# Altium schematic sheet 08-DPLL-2.SchDoc
size B; SheetNumber: 8; SheetTotal: 22
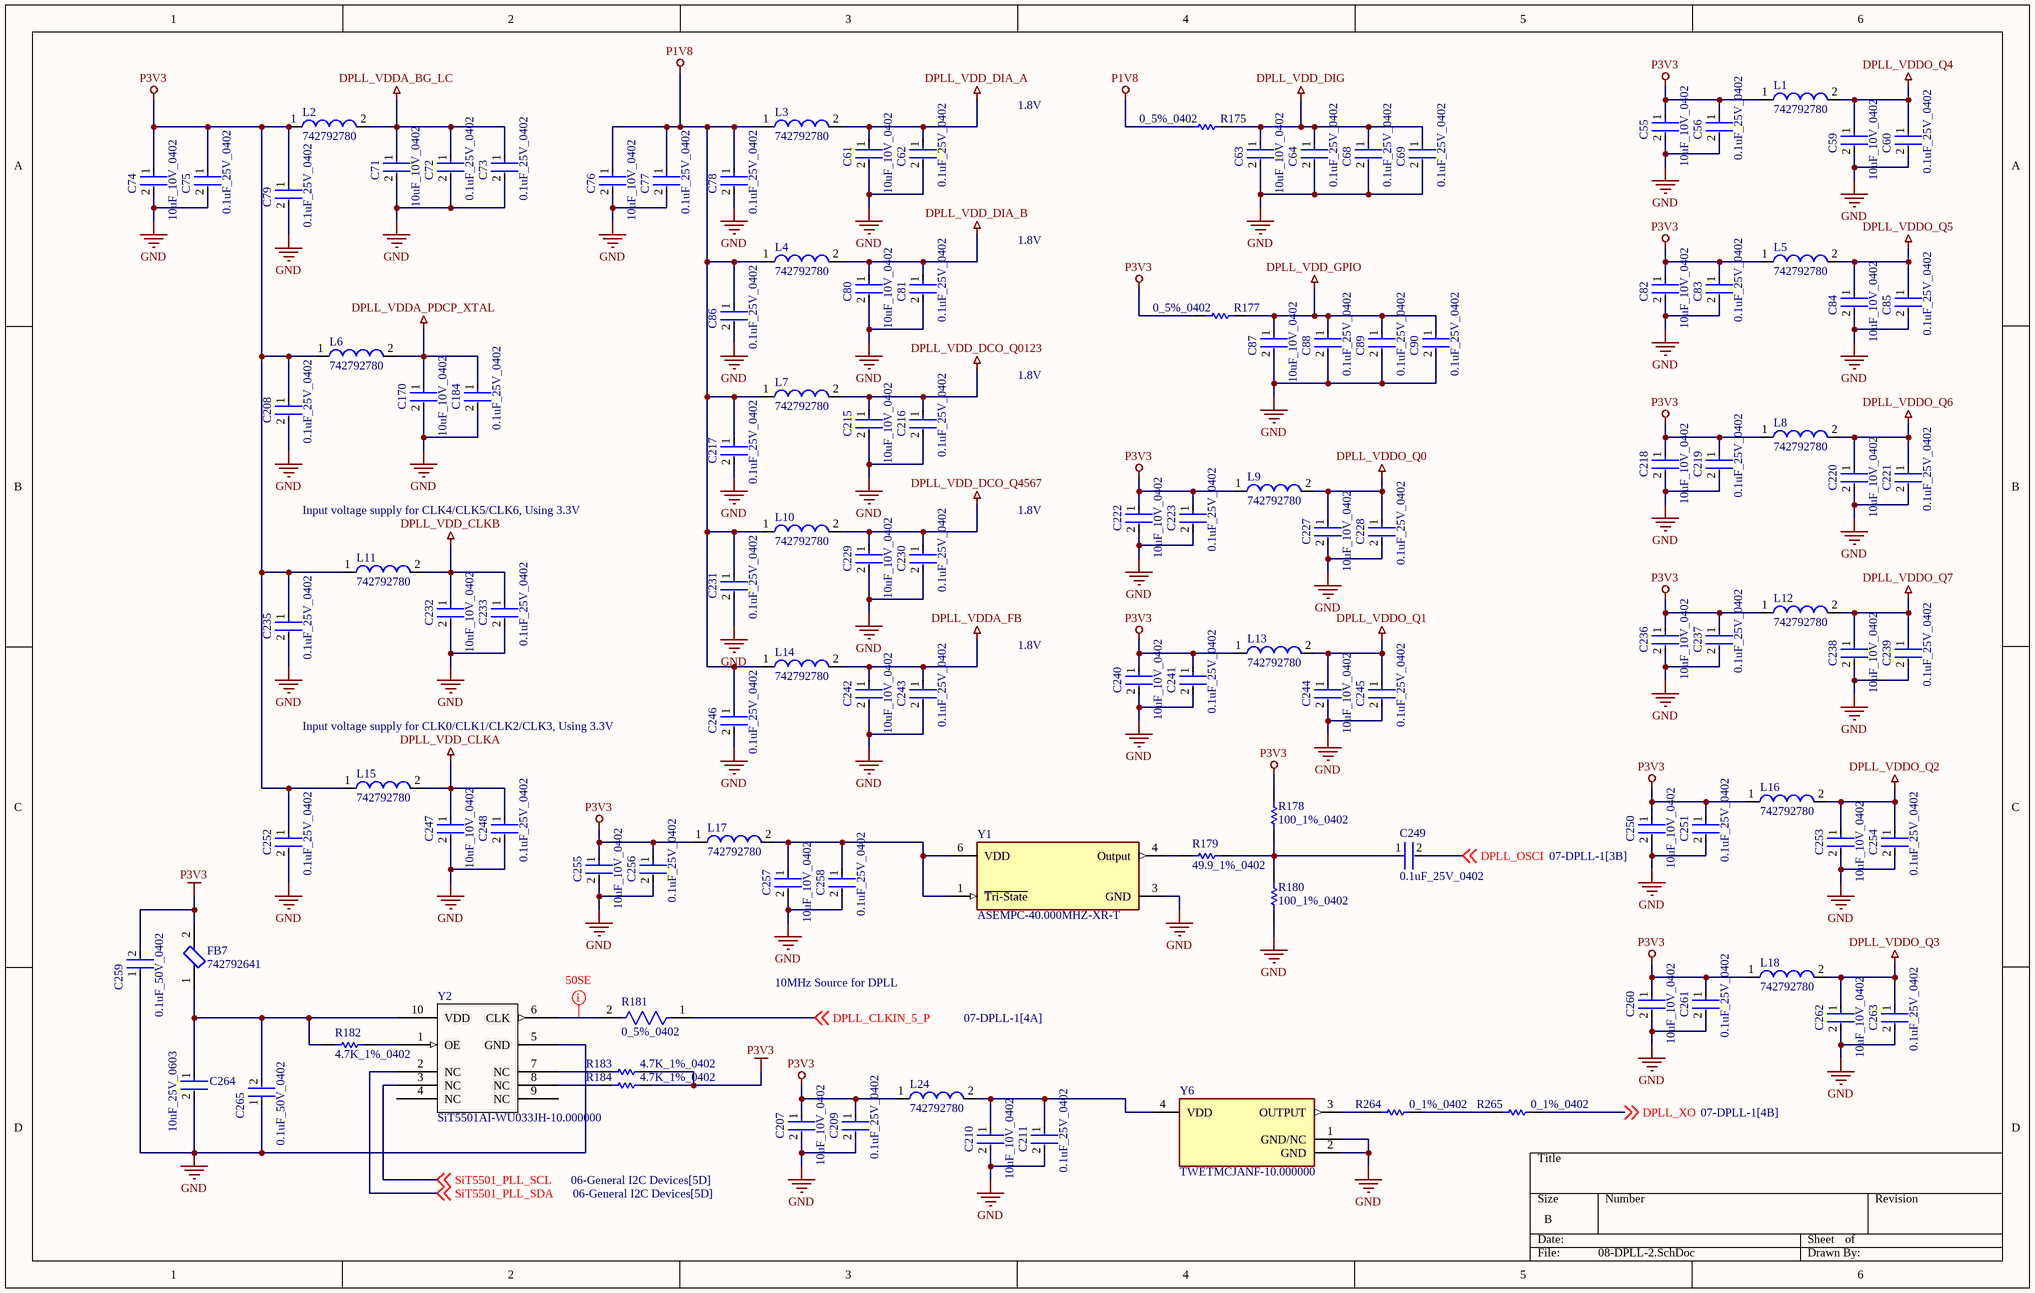
[diagram p0: 08-DPLL-2.SchDoc]

## Parts
C55  10uF_10V_0402  [FP-CL05A106MP5NUNC-MFG]
C56  0.1uF_25V_0402  [FP-0402-L_1_0_1-W_0_5_0_1-IPC_C]
C59  10uF_10V_0402  [FP-CL05A106MP5NUNC-MFG]
C60  0.1uF_25V_0402  [FP-0402-L_1_0_1-W_0_5_0_1-IPC_C]
C61  10uF_10V_0402  [FP-CL05A106MP5NUNC-MFG]
C62  0.1uF_25V_0402  [FP-0402-L_1_0_1-W_0_5_0_1-IPC_C]
C63  10uF_10V_0402  [FP-CL05A106MP5NUNC-MFG]
C64  0.1uF_25V_0402  [FP-0402-L_1_0_1-W_0_5_0_1-IPC_C]
C68  0.1uF_25V_0402  [FP-0402-L_1_0_1-W_0_5_0_1-IPC_C]
C69  0.1uF_25V_0402  [FP-0402-L_1_0_1-W_0_5_0_1-IPC_C]
C71  10uF_10V_0402  [FP-CL05A106MP5NUNC-MFG]
C72  0.1uF_25V_0402  [FP-0402-L_1_0_1-W_0_5_0_1-IPC_C]
C73  0.1uF_25V_0402  [FP-0402-L_1_0_1-W_0_5_0_1-IPC_C]
C74  10uF_10V_0402  [FP-CL05A106MP5NUNC-MFG]
C75  0.1uF_25V_0402  [FP-0402-L_1_0_1-W_0_5_0_1-IPC_C]
C76  10uF_10V_0402  [FP-CL05A106MP5NUNC-MFG]
C77  0.1uF_25V_0402  [FP-0402-L_1_0_1-W_0_5_0_1-IPC_C]
C78  0.1uF_25V_0402  [FP-0402-L_1_0_1-W_0_5_0_1-IPC_C]
C79  0.1uF_25V_0402  [FP-0402-L_1_0_1-W_0_5_0_1-IPC_C]
C80  10uF_10V_0402  [FP-CL05A106MP5NUNC-MFG]
C81  0.1uF_25V_0402  [FP-0402-L_1_0_1-W_0_5_0_1-IPC_C]
C82  10uF_10V_0402  [FP-CL05A106MP5NUNC-MFG]
C83  0.1uF_25V_0402  [FP-0402-L_1_0_1-W_0_5_0_1-IPC_C]
C84  10uF_10V_0402  [FP-CL05A106MP5NUNC-MFG]
C85  0.1uF_25V_0402  [FP-0402-L_1_0_1-W_0_5_0_1-IPC_C]
C86  0.1uF_25V_0402  [FP-0402-L_1_0_1-W_0_5_0_1-IPC_C]
C87  10uF_10V_0402  [FP-CL05A106MP5NUNC-MFG]
C88  0.1uF_25V_0402  [FP-0402-L_1_0_1-W_0_5_0_1-IPC_C]
C89  0.1uF_25V_0402  [FP-0402-L_1_0_1-W_0_5_0_1-IPC_C]
C90  0.1uF_25V_0402  [FP-0402-L_1_0_1-W_0_5_0_1-IPC_C]
C170  10uF_10V_0402  [FP-CL05A106MP5NUNC-MFG]
C184  0.1uF_25V_0402  [FP-0402-L_1_0_1-W_0_5_0_1-IPC_C]
C207  10uF_10V_0402  [FP-CL05A106MP5NUNC-MFG]
C208  0.1uF_25V_0402  [FP-0402-L_1_0_1-W_0_5_0_1-IPC_C]
C209  0.1uF_25V_0402  [FP-0402-L_1_0_1-W_0_5_0_1-IPC_C]
C210  10uF_10V_0402  [FP-CL05A106MP5NUNC-MFG]
C211  0.1uF_25V_0402  [FP-0402-L_1_0_1-W_0_5_0_1-IPC_C]
C215  10uF_10V_0402  [FP-CL05A106MP5NUNC-MFG]
C216  0.1uF_25V_0402  [FP-0402-L_1_0_1-W_0_5_0_1-IPC_C]
C217  0.1uF_25V_0402  [FP-0402-L_1_0_1-W_0_5_0_1-IPC_C]
C218  10uF_10V_0402  [FP-CL05A106MP5NUNC-MFG]
C219  0.1uF_25V_0402  [FP-0402-L_1_0_1-W_0_5_0_1-IPC_C]
C220  10uF_10V_0402  [FP-CL05A106MP5NUNC-MFG]
C221  0.1uF_25V_0402  [FP-0402-L_1_0_1-W_0_5_0_1-IPC_C]
C222  10uF_10V_0402  [FP-CL05A106MP5NUNC-MFG]
C223  0.1uF_25V_0402  [FP-0402-L_1_0_1-W_0_5_0_1-IPC_C]
C227  10uF_10V_0402  [FP-CL05A106MP5NUNC-MFG]
C228  0.1uF_25V_0402  [FP-0402-L_1_0_1-W_0_5_0_1-IPC_C]
C229  10uF_10V_0402  [FP-CL05A106MP5NUNC-MFG]
C230  0.1uF_25V_0402  [FP-0402-L_1_0_1-W_0_5_0_1-IPC_C]
C231  0.1uF_25V_0402  [FP-0402-L_1_0_1-W_0_5_0_1-IPC_C]
C232  10uF_10V_0402  [FP-CL05A106MP5NUNC-MFG]
C233  0.1uF_25V_0402  [FP-0402-L_1_0_1-W_0_5_0_1-IPC_C]
C235  0.1uF_25V_0402  [FP-0402-L_1_0_1-W_0_5_0_1-IPC_C]
C236  10uF_10V_0402  [FP-CL05A106MP5NUNC-MFG]
C237  0.1uF_25V_0402  [FP-0402-L_1_0_1-W_0_5_0_1-IPC_C]
C238  10uF_10V_0402  [FP-CL05A106MP5NUNC-MFG]
C239  0.1uF_25V_0402  [FP-0402-L_1_0_1-W_0_5_0_1-IPC_C]
C240  10uF_10V_0402  [FP-CL05A106MP5NUNC-MFG]
C241  0.1uF_25V_0402  [FP-0402-L_1_0_1-W_0_5_0_1-IPC_C]
C242  10uF_10V_0402  [FP-CL05A106MP5NUNC-MFG]
C243  0.1uF_25V_0402  [FP-0402-L_1_0_1-W_0_5_0_1-IPC_C]
C244  10uF_10V_0402  [FP-CL05A106MP5NUNC-MFG]
C245  0.1uF_25V_0402  [FP-0402-L_1_0_1-W_0_5_0_1-IPC_C]
C246  0.1uF_25V_0402  [FP-0402-L_1_0_1-W_0_5_0_1-IPC_C]
C247  10uF_10V_0402  [FP-CL05A106MP5NUNC-MFG]
C248  0.1uF_25V_0402  [FP-0402-L_1_0_1-W_0_5_0_1-IPC_C]
C249  0.1uF_25V_0402  [FP-0402-L_1_0_1-W_0_5_0_1-IPC_C]
C250  10uF_10V_0402  [FP-CL05A106MP5NUNC-MFG]
C251  0.1uF_25V_0402  [FP-0402-L_1_0_1-W_0_5_0_1-IPC_C]
C252  0.1uF_25V_0402  [FP-0402-L_1_0_1-W_0_5_0_1-IPC_C]
C253  10uF_10V_0402  [FP-CL05A106MP5NUNC-MFG]
C254  0.1uF_25V_0402  [FP-0402-L_1_0_1-W_0_5_0_1-IPC_C]
C255  10uF_10V_0402  [FP-CL05A106MP5NUNC-MFG]
C256  0.1uF_25V_0402  [FP-0402-L_1_0_1-W_0_5_0_1-IPC_C]
C257  10uF_10V_0402  [FP-CL05A106MP5NUNC-MFG]
C258  0.1uF_25V_0402  [FP-0402-L_1_0_1-W_0_5_0_1-IPC_C]
C259  0.1uF_50V_0402  [FP-C1005-050-0_05-IPC_C]
C260  10uF_10V_0402  [FP-CL05A106MP5NUNC-MFG]
C261  0.1uF_25V_0402  [FP-0402-L_1_0_1-W_0_5_0_1-IPC_C]
C262  10uF_10V_0402  [FP-CL05A106MP5NUNC-MFG]
C263  0.1uF_25V_0402  [FP-0402-L_1_0_1-W_0_5_0_1-IPC_C]
C264  10uF_25V_0603  [FP-CL10-IPC_C]
C265  0.1uF_50V_0402  [FP-C1005-050-0_05-IPC_C]
FB7  742792641  [FP-742792641-MFG]
L1  742792780  [SMD-0402]
L2  742792780  [SMD-0402]
L3  742792780  [SMD-0402]
L4  742792780  [SMD-0402]
L5  742792780  [SMD-0402]
L6  742792780  [SMD-0402]
L7  742792780  [SMD-0402]
L8  742792780  [SMD-0402]
L9  742792780  [SMD-0402]
L10  742792780  [SMD-0402]
L11  742792780  [SMD-0402]
L12  742792780  [SMD-0402]
L13  742792780  [SMD-0402]
L14  742792780  [SMD-0402]
L15  742792780  [SMD-0402]
L16  742792780  [SMD-0402]
L17  742792780  [SMD-0402]
L18  742792780  [SMD-0402]
L24  742792780  [SMD-0402]
R175  0_5%_0402  [RESC1005X40X25LL10T10]
R177  0_5%_0402  [RESC1005X40X25LL10T10]
R178  100_1%_0402  [RESC1005X40X25ML05T10]
R179  49.9_1%_0402  [RESC1005X40X25NL10T10]
R180  100_1%_0402  [RESC1005X40X25ML05T10]
R181  0_5%_0402  [FP-AC0402-0_37-IPC_B]
R182  4.7K_1%_0402  [RESC1005X40X25NL10T10]
R183  4.7K_1%_0402  [RESC1005X40X25NL10T10]
R184  4.7K_1%_0402  [RESC1005X40X25NL10T10]
R264  0_1%_0402  [RESC1005X40X25LL05T05]
R265  0_1%_0402  [RESC1005X40X25LL05T05]
Y1  ASEMPC-40.000MHZ-XR-T  [FP-ASEMP-CMOS-MFG]
Y2  Manufacturer Part Number: SiT5501AI-WU033JH-10.000000  [SITIME_SPL-086-CQFN-010-C07050_REV_DRAFT]  (hidden comment: SiTime_SiT5501AC-WU-33E0-10T)
Y6  TWETMCJANF-10.000000  [FP-TWETMCJANF-10_000000-MFG]

## Nets
DPLL_VDD_CLKA: C247.1 C248.1 L15.2
DPLL_VDD_CLKB: C232.1 C233.1 L11.2
DPLL_VDD_DCO_Q0123: C215.1 C216.1 L7.2
DPLL_VDD_DCO_Q4567: C229.1 C230.1 L10.2
DPLL_VDD_DIA_A: C61.1 C62.1 L3.2
DPLL_VDD_DIA_B: C80.1 C81.1 L4.2
DPLL_VDD_DIG: C63.1 C64.1 C68.1 C69.1 R175.2
DPLL_VDD_GPIO: C87.1 C88.1 C89.1 C90.1 R177.2
DPLL_VDDA_BG_LC: C71.1 C72.1 C73.1 L2.2
DPLL_VDDA_FB: C242.1 C243.1 L14.2
DPLL_VDDA_PDCP_XTAL: C170.1 C184.1 L6.2
DPLL_VDDO_Q0: C227.1 C228.1 L9.2
DPLL_VDDO_Q1: C244.1 C245.1 L13.2
DPLL_VDDO_Q2: C253.1 C254.1 L16.2
DPLL_VDDO_Q3: C262.1 C263.1 L18.2
DPLL_VDDO_Q4: C59.1 C60.1 L1.2
DPLL_VDDO_Q5: C84.1 C85.1 L5.2
DPLL_VDDO_Q6: C220.1 C221.1 L8.2
DPLL_VDDO_Q7: C238.1 C239.1 L12.2
GND: C55.2 C56.2 C59.2 C60.2 C61.2 C62.2 C63.2 C64.2 C68.2 C69.2 C71.2 C72.2 C73.2 C74.2 C75.2 C76.2 C77.2 C78.2 C79.2 C80.2 C81.2 C82.2 C83.2 C84.2 C85.2 C86.2 C87.2 C88.2 C89.2 C90.2 C170.2 C184.2 C207.2 C208.2 C209.2 C210.2 C211.2 C215.2 C216.2 C217.2 C218.2 C219.2 C220.2 C221.2 C222.2 C223.2 C227.2 C228.2 C229.2 C230.2 C231.2 C232.2 C233.2 C235.2 C236.2 C237.2 C238.2 C239.2 C240.2 C241.2 C242.2 C243.2 C244.2 C245.2 C246.2 C247.2 C248.2 C250.2 C251.2 C252.2 C253.2 C254.2 C255.2 C256.2 C257.2 C258.2 C259.1 C260.2 C261.2 C262.2 C263.2 C264.2 C265.1 R180.1 Y1.3(GND) Y2.5(GND) Y6.1(GND/NC) Y6.2(GND)
P1V8: C76.1 C77.1 C78.1 C86.1 C217.1 C231.1 C246.1 L3.1 L4.1 L7.1 L10.1 L14.1 R175.1
P3V3: C55.1 C56.1 C74.1 C75.1 C79.1 C82.1 C83.1 C207.1 C208.1 C209.1 C218.1 C219.1 C222.1 C223.1 C235.1 C236.1 C237.1 C240.1 C241.1 C250.1 C251.1 C252.1 C255.1 C256.1 C259.2 C260.1 C261.1 FB7.2 L1.1 L2.1 L5.1 L6.1 L8.1 L9.1 L11.1 L12.1 L13.1 L15.1 L16.1 L17.1 L18.1 L24.1 R177.1 R178.2 R183.2 R184.2
DPLL_CLKIN_5_P: R181.1 ; off-sheet DPLL_CLKIN_5_P
DPLL_OSCI: C249.2 ; off-sheet DPLL_OSCI
DPLL_XO: R265.2 ; off-sheet DPLL_XO
SiT5501_PLL_SCL: Y2.3(NC) ; off-sheet SiT5501_PLL_SCL
SiT5501_PLL_SDA: Y2.2(NC) ; off-sheet SiT5501_PLL_SDA
NetC210_1: C210.1 C211.1 L24.2 Y6.4(VDD)
NetC249_1: C249.1 R178.1 R179.2 R180.2
NetC257_1: C257.1 C258.1 L17.2 Y1.1(~{Tri-State}) Y1.6(VDD)
NetC264_1: C264.1 C265.2 FB7.1 R182.1 Y2.10(VDD)
NetR179_1: R179.1 Y1.4(Output)
NetR181_2: R181.2 Y2.6(CLK)
NetR182_2: R182.2 Y2.1(OE)
NetR183_1: R183.1 Y2.7(NC)
NetR184_1: R184.1 Y2.8(NC)
NetR264_1: R264.1 Y6.3(OUTPUT)
NetR264_2: R264.2 R265.1

Not connected (* = marked no-connect by the designer): Y2 4(NC) 9(NC)

## Layout directives
net class 50SE: NetR181_2

## Notes on the sheet
- 1.8V
- Input voltage supply for CLK4/CLK5/CLK6, Using 3.3V
- Input voltage supply for CLK0/CLK1/CLK2/CLK3, Using 3.3V
- 10MHz Source for DPLL

## Library data of the parts
C55 C59 C61 C63 C71 C74 C76 C80 C82 C84 C87 C170 C207 C210 C215 C218 C220 C222 C227 C229 C232 C236 C238 C240 C242 C244 C247 C250 C253 C255 C257 C260 C262 = CMP-13271-000002-1: CAP CER 10UF 10V X5R 0402; Manufacturer Part Number: CL05A106MP5NUNC; Manufacturer: Samsung; Temperature Coefficient: 15%; Tolerance: 20%; Material: Ceramic; Octopart: https://octopart.com/cl05a106mp5nunc-samsung-22457395; Voltage Rating: 10V; RoHS: TRUE; Value: 10uF; Height: 0.7mm; Digikey Description: CAP CER 10UF 10V X5R 0402; Automotive: No; Package: CL05A106MP5NUNC; Device Class L1: Passive Components; Capacitance: 10uF; Temperature Range High: +85°C; ComponentLink2Description: Datasheet; Device Class L2: Capacitors; Temperature Characteristic: X5R; Temperature: -55°C to +85°C; ComponentLink2URL: http://www.samsungsem.com/kr/support/product-search/mlcc/__icsFiles/afieldfile/2019/05/10/19-CL05A106MP5NUNC.pdf; Device Class L3: Ceramic Capacitors; Category: Cap; Temperature Range Low: -55°C; Ipc Land Pattern Name: CAPC10050X50; Lead Free: Yes
C56 C60 C62 C64 C68 C69 C72 C73 C75 C77-C79 C81 C83 C85 C86 C88-C90 C184 C208 C209 C211 C216 C217 C219 C221 C223 C228 C230 C231 C233 C235 C237 C239 C241 C243 C245 C246 C248 C249 C251 C252 C254 C256 C258 C261 C263 = CMP-2008-02519-2: General Purpose Ceramic Capacitor, 0402, 100nF, 10%, X7R, 15%, 25V; Package Quantity: 1; Capacitance: 100nF; Min Operating Temperature: -55°C; Voltage: 25V; Voltage Rating: 25V; Construction: Flat; Max Operating Temperature: 125°C; Radiation Hardening: No; Depth: 0.5mm; Thickness: 0.022inch; Voltage Rating (DC): 25V; Number of Pins: 2; Lead Free: Lead Free; Series: -; REACH SVHC: No SVHC; Length: 1mm; Dielectric: X7R; RoHS Compliant: Yes; Mount: Surface Mount; Packaging: Tape and Reel; Case/Package: 0402; Case Code (Imperial): 0402; Termination: SMD/SMT; Width: 0.02inch; Case Code (Metric): 1005; Tolerance: 10%
C259 C265 = CMP-2000-05393-2: Multilayer Ceramic Capacitors 100nF ±10% 50V X7R SMD 0402; Voltage: 50V; Dielectric Material: Ceramic; Min Operating Temperature: -55°C; Depth: 0.5mm; Radiation Hardening: No; RoHS Compliant: Yes; Voltage Rating (DC): 50V; Lead Free: Lead Free; Resistor Type: Ceramic; Height: 0.5mm; Dielectric: X7R; Thickness: 0.022inch; Case/Package: 0402; Case Code (Metric): 1005; Termination: SMD/SMT; Capacitance: 100nF; Packaging: Tape and Reel; Max Operating Temperature: 125°C; Mount: Surface Mount; Package Quantity: 1; Width: 0.02inch; Weight: 2.3E-05oz; Voltage Rating: 50V; Tolerance: 10%; Construction: Flat; Case Code (Imperial): 0402; Length: 1mm; REACH SVHC: No SVHC; Series: C
C264 = CMP-13271-004224-1: Cap Ceramic 10uF 25V X5R ±20% Pad SMD 0603 +85°C T/R; Width: 0.031inch; Voltage Rating: 25V; Length: 0.063inch; Case Code (Metric): 1608; Dielectric: X5R; Termination: Wraparound; Capacitance: 10uF; Lead Free: Lead Free; Mount: Surface Mount; Package Quantity: 1; Case Code (Imperial): 0603; Thickness: 0.035inch; Packaging: Tape and Reel; Contact Plating: Tin; Min Operating Temperature: -55°C; Tolerance: 20%; Max Operating Temperature: 85°C; Case/Package: 0603
FB7 = CMP-0220-00171-2: FERRITE BEAD 300 OHM 0603 1LN; Inductance: 18nH; Max DC Current: 2A; Number of Lines: 1; Test Frequency: 100MHz; Impedance: 300R; DC Resistance (DCR): 150mR; Tolerance: 25%; Case Code (Metric): 1608; Core Material: Ferrite; Length: 1.6mm; Lead Free: Lead Free; Series: WE-CBF; Min Operating Temperature: -55°C; RoHS Compliant: Yes; Case/Package: SMD/SMT; Material: Ferrite; Max Operating Temperature: 125°C; Termination: SMD/SMT; Packaging: Tape and Reel; Weight: 0.000141oz; Case Code (Imperial): 0603; Width: 0.8mm; Mount: Surface Mount; Max Current Rating: 2A; Package Quantity: 1; Depth: 0.8mm; Current Rating: 2A; Height: 0.8mm
L1-L18 L24 = CMP-0220-00137-1: SMD EMI Suppression Ferrite Bead WE-CBF, Z = 220 Ohm; Impedance: 220 Ohm; PackageVersion: 2009; DatasheetVersion: ver 4, Jul-2009; PackageDescription: Chip Inductor, 2-Leads, Body 1.0 x 0.5 mm; ComponentLink1URL: http://www.we-online.com; ComponentLink1Description: Manufacturer Link; ComponentLink2URL: http://www.we-online.de/katalog/media/pdf/742792780.pdf; PackageReference: SMD-0402; ComponentLink2Description: Datasheet
R175 R177 = CMP-2002-04569-1: Manufacturer: KOA Speer; Part Number: RK73Z1ETTP
R178 R180 = CMP-2002-06458-1: Part Number: ERJ-U02F1000X; Manufacturer: Panasonic
R179 = CMP-2002-04448-1: Part Number: RK73H1ETTP49R9F; Manufacturer: KOA Speer
R181 = CMP-2002-01772-2: RESISTOR 0402 JUMPER ZERO OHM; Voltage Rating: 50V; Temperature Coefficient: 200ppm/°C; Tolerance: 1%; Power Rating: 62.5mW; Resistance: 0R; Min Operating Temperature: -55°C; Termination: SMD/SMT; Case/Package: 0402; Case Code (Imperial): 0402; Packaging: Tape and Reel; Case Code (Metric): 1005; Max Operating Temperature: 155°C; Series: AC
R182-R184 = CMP-2002-05217-1: Manufacturer: Bourns; Part Number: CR0402-FX-4701GLF
R264 R265 = CMP-2000-07451-1: Chip Resistor, 0 Ohm, 0.1 W, -55 to 155 degC, 0402 (1005 Metric), RoHS, Tape and Reel; Manufacturer: Panasonic; Voltage Rating (DC): 50V; Temperature Coefficient: 600ppm/��C; Max Power Dissipation: 100mW; Resistance: 0mOhm; Tolerance: 5%; Number of Terminations: 2; Mount: SurfaceMount; Height: 0.35mm; Packaging: TapeandReel; Contact Plating: Tin; Manufacturer URL: http://www.panasonic.com/; Composition: ThickFilm; Max Operating Temperature: 155degC; REACH SVHC: NoSVHC; Case/Package: 0402; Package Reference: 402; Depth: 0.5mm; Package Description: 2-Pin Surface Mount Device, Body 1 x 0.5 mm; Datasheet URL: https://industrial.panasonic.com/cdbs/www-data/pdf/RDA0000/AOA0000C301.pdf; RoHSCompliant: True; Case Code (Imperial): 0402; Military Standard: Not; Min Operating Temperature: -55degC; Power Rating: 100mW; Datasheet Version: 03/2015; Length: 1mm; Case Code (Metric): 1005; Termination: SMD/SMT; Mounting Technology: SurfaceMount; Voltage Rating: 50V; Width: 0.02inch; Package Quantity: 1; Lead Free: LeadFree; Radiation Hardening: No
Y1 = CMP-27762-012912-1: MEMS Oscillator 40MHz ±25ppm CMOS 2.25V~3.6V 6-SMD 3.2mm x 2.5mm; Max Supply Current: 35mA; Max Duty Cycle: 55%; Operating Supply Voltage: 3.3V; Max Supply Voltage: 3.6V; Load Capacitance: 15pF; Min Supply Voltage: 2.25V; Termination: SMD/SMT; Frequency: 40MHz; Length: 0.126inch; Case/Package: SMD/SMT; Max Operating Temperature: 105°C; RoHS Compliant: Yes; Mount: Surface Mount; Packaging: Tape and Reel; Number of Pins: 6; Width: 0.098inch; Min Operating Temperature: -40°C; Frequency Stability: 25ppm; Height: 0.035inch; Package Quantity: 1000
Y2 = CMP-OSC-00029-2: OSC, MEMS, STRATUM 3E, 10.000MHZ, 10PPB STAB, LVCMOS, 3.3V, O/P EN, 7.0X5.0X2.2MM, CQFN-10; Manufacturer: SiTime; Frequency: 10 MHz; Voltage - Supply: 3.3 V; Type: OCXO; Category: Oscillators; Max Operating Temperature: 70°C; Min Operating Temperature: -20°C; Height: 2.20mm (max); Case/Package: 10 Lead QFN; Output: LVCMOS; Mounting Type: Surface Mount; Frequency Stability: ±10 ppb; RoHS: Yes
Y6 = CMP-23139-000002-1: XTAL OSC TCXO 10.0000MHZ CMOS; Manufacturer: Taitien; Max Supply Current: 6mA; Stability: 0.1ppm; Load Capacitance: 15pF; Frequency: 10MHz; Max Supply Voltage: 3.465V; Min Supply Voltage: 3.135V; Package: 0; Category: Crys; Height: 1.65mm; Device Class L2: Crystals / Oscillators; Manufacturer Part Number: TWETMCJANF-10.000000; RoHS: TRUE; Device Class L1: Passive Components; Temperature Range High: +70°C; Lead Free: Yes; Series: TW; ComponentLink2URL: https://www.taitien.com/wp-content/uploads/2015/12/XO-0084_TW_TYPE_TCXO.pdf; Automotive: No; Temperature Range Low: -20°C; Octopart: https://octopart.com/twetmcjanf-10.000000-taitien-75080612; Temperature: -20°C to +70°C; Device Class L3: Oscillators; Digikey Description: XTAL OSC TCXO 10.0000MHZ CMOS; ComponentLink2Description: Datasheet